# EAGLE design clock1_v1 (EAGLE 9.6.2)
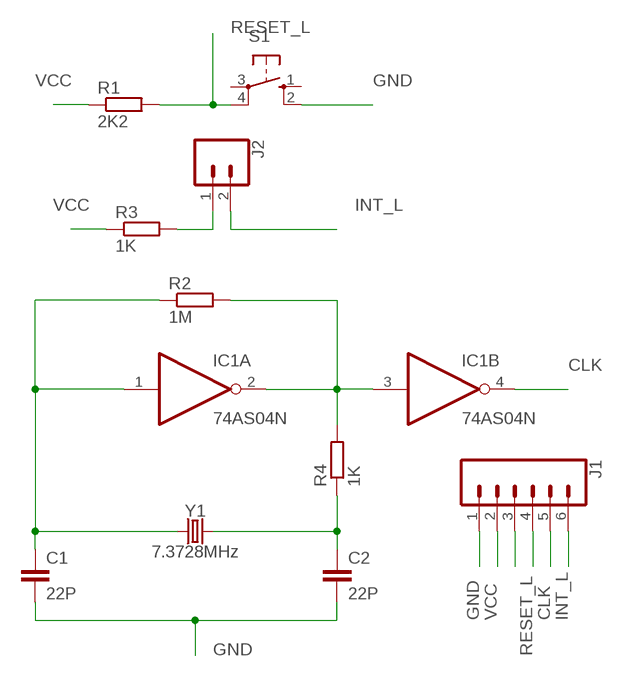
[diagram p0: schematic, sheet 1]

## Parts
C1  22P  C-EU025-024X044  [C025-024X044]
C2  22P  C-EU025-024X044  [C025-024X044]
IC1  74AS04N  [DIL14]
J1  CONN_06LONGPADS  [1X06_LONGPADS]
J2  CONN_02PTH3  [1X02_LONGPADS]
R1  2K2  R-EU_0204/5  [0204/5]
R2  1M  R-EU_0204/5  [0204/5]
R3  1K  R-EU_0204/5  [0204/5]
R4  1K  R-EU_0204/5  [0204/5]
S1  10-XX  [B3F-10XX]
Y1  7.3728MHz  CRYSTALPTH-HC49UV  [HC49U]

## Nets
CLK: IC1.4(B:O) J1.5
GND: C1.2 C2.2 J1.1 S1.2(S1)
INT_L: J1.6 J2.2
N$1: C1.1 IC1.1(A:I) R2.1 Y1.1
N$2: C2.1 R4.1 Y1.2
N$3: J1.3
N$4: IC1.2(A:O) IC1.3(B:I) R2.2 R4.2
N$6: J2.1 R3.2
RESET_L: J1.4 R1.2 S1.4(P1)
VCC: J1.2 R1.1 R3.1
Unconnected: IC1.5(C:I) IC1.6(C:O) IC1.8(D:O) IC1.9(D:I) IC1.10(E:O) IC1.11(E:I) IC1.12(F:O) IC1.13(F:I) S1.1(S) S1.3(P)

## Power pins joined to a net without a drawn wire
GND: IC1.7(P:GND)
VCC: IC1.14(P:VCC)

## Library data of the parts
C1 C2 = rcl:C-EU: CAPACITOR, European symbol; SPICEPREFIX: C
IC1 = 74xx-eu:74*04: Hex INVERTER
J1 = SparkFun-Connectors:CONN_06: Multi connection point. Often used as Generic Header-pin footprint for 0.1 inch spaced/style header connections On any of the 0.1 inch spaced packages, you can populate with these: Break Away Headers - Straight <https://www.sparkfun.com/products/116> (PRT-00116) Break Away Male Headers - Right Angle <https://www.sparkfun.com/products/553> (PRT-00553) Female Headers <https://www.sparkfun.com/products/115> (PRT-00115) Break Away Headers - Machine Pin <https://www.sparkfun.com/products/117> (PRT-00117) Break Away Female Headers - Swiss Machine Pin <https://www.sparkfun.com/products/743> (PRT-00743) Arduino Stackable Header - 6 Pin <https://www.sparkfun.com/products/9280> (PRT-09280) For SCREWTERMINALS and SPRING TERMINALS visit here: Screw Terimnals on SparkFun.com <https://www.sparkfun.com/search/results?term=Screw+Terminals> (5mm/3.5mm/2.54mm spacing) This device is also useful as a general connection point to wire up your design to another part of your project. Our various solder wires solder well into these plated through hole pads. Hook-Up Wire - Assortment (Stranded, 22 AWG) <https://www.sparkfun.com/products/11375> (PRT-11375) Hook-Up Wire - Assortment (Solid Core, 22 AWG) <https://www.sparkfun.com/products/11367> (PRT-11367) View the entire wire category on our website here <https://www.sparkfun.com/categories/141>
J2 = SparkFun-Connectors:CONN_02: Multi connection point. Often used as Generic Header-pin footprint for 0.1 inch spaced/style header connections On any of the 0.1 inch spaced packages, you can populate with these: Break Away Headers - Straight <https://www.sparkfun.com/products/116> (PRT-00116) Break Away Male Headers - Right Angle <https://www.sparkfun.com/products/553> (PRT-00553) Female Headers <https://www.sparkfun.com/products/115> (PRT-00115) Break Away Headers - Machine Pin <https://www.sparkfun.com/products/117> (PRT-00117) Break Away Female Headers - Swiss Machine Pin <https://www.sparkfun.com/products/743> (PRT-00743) For SCREWTERMINALS and SPRING TERMINALS visit here: Screw Terimnals on SparkFun.com <https://www.sparkfun.com/search/results?term=Screw+Terminals> (5mm/3.5mm/2.54mm spacing) This device is also useful as a general connection point to wire up your design to another part of your project. Our various solder wires solder well into these plated through hole pads. Hook-Up Wire - Assortment (Stranded, 22 AWG) <https://www.sparkfun.com/products/11375> (PRT-11375) Hook-Up Wire - Assortment (Solid Core, 22 AWG) <https://www.sparkfun.com/products/11367> (PRT-11367) View the entire wire category on our website here <https://www.sparkfun.com/categories/141> Special notes: Molex polarized connector foot print use with: PRT-08233 with associated crimp pins and housings. 2.54_SCREWTERM for use with PRT-10571. 3.5mm Screw Terminal footprints for PRT-08084 5mm Screw Terminal footprints for use with PRT-08432
R1-R4 = rcl:R-EU_: RESISTOR, European symbol; SPICEPREFIX: R
S1 = switch-omron:10-XX: OMRON SWITCH; MPN: B3F-1000; OC_FARNELL: 176432; OC_NEWARK: 36M3542
Y1 = SparkFun-Clocks:CRYSTAL: Crystals (Generic) These are passive quartz crystals, which can be used as a clock source for a microcontroller. Crystal's are two-terminal devices. They require external "load" capacitors to generate an oscillating signal.

## Board
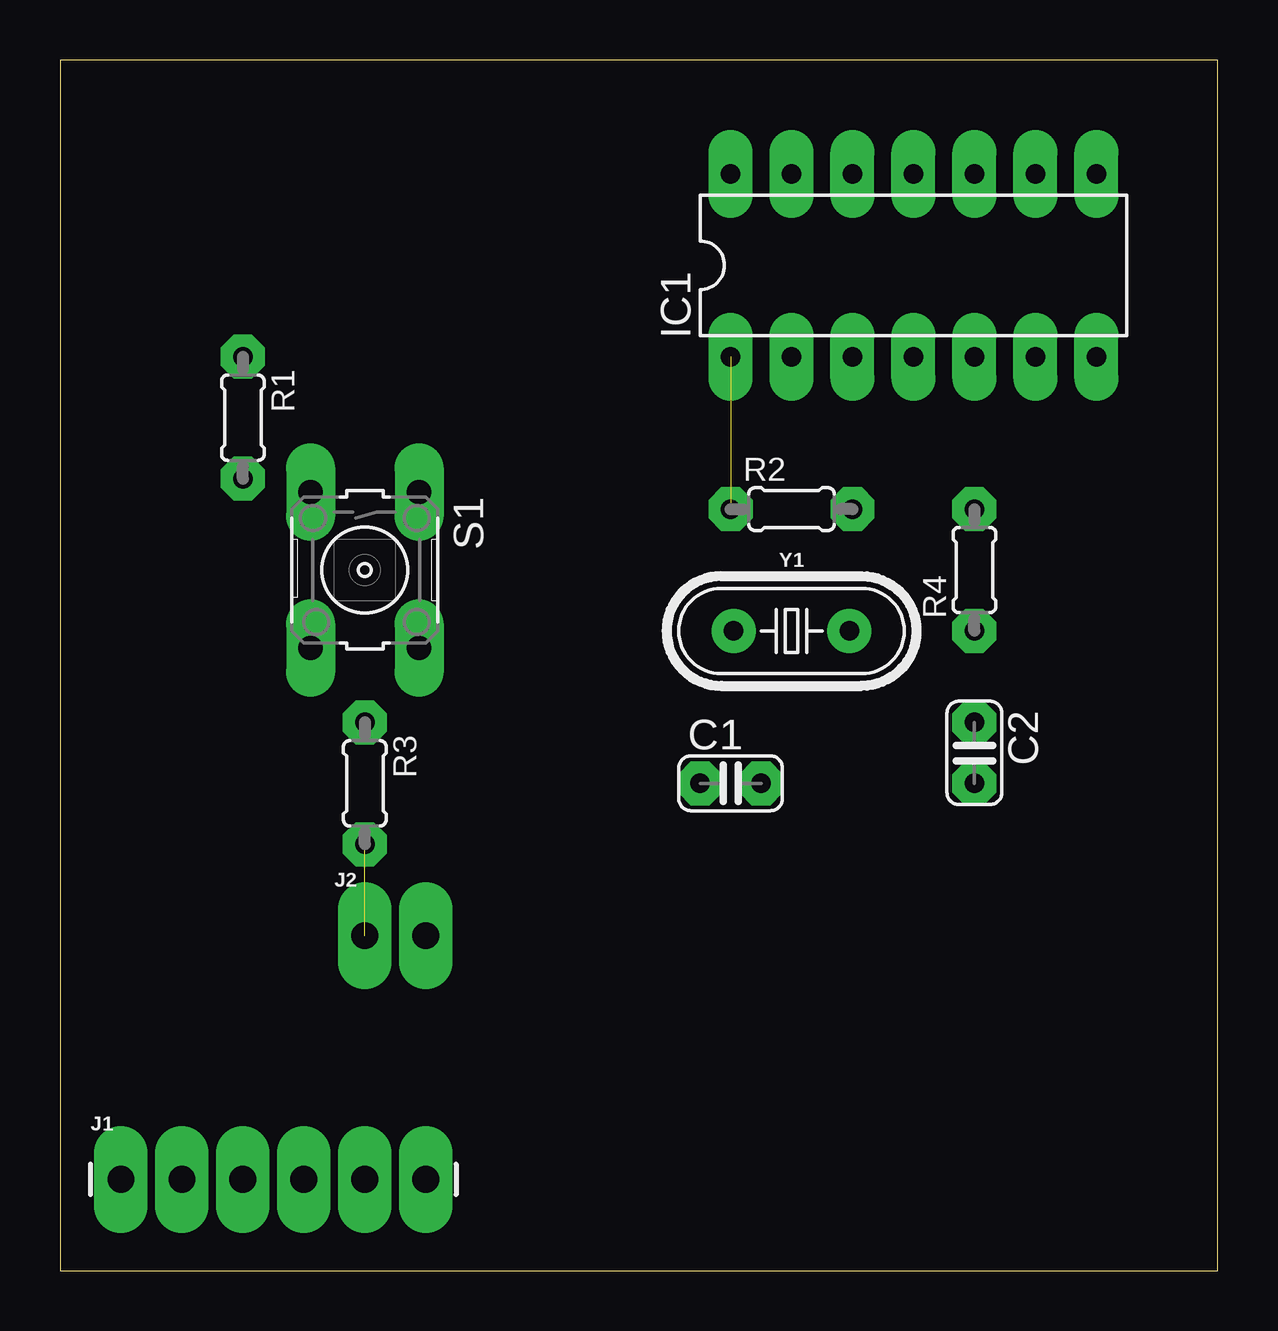
[diagram p1: board, top side]
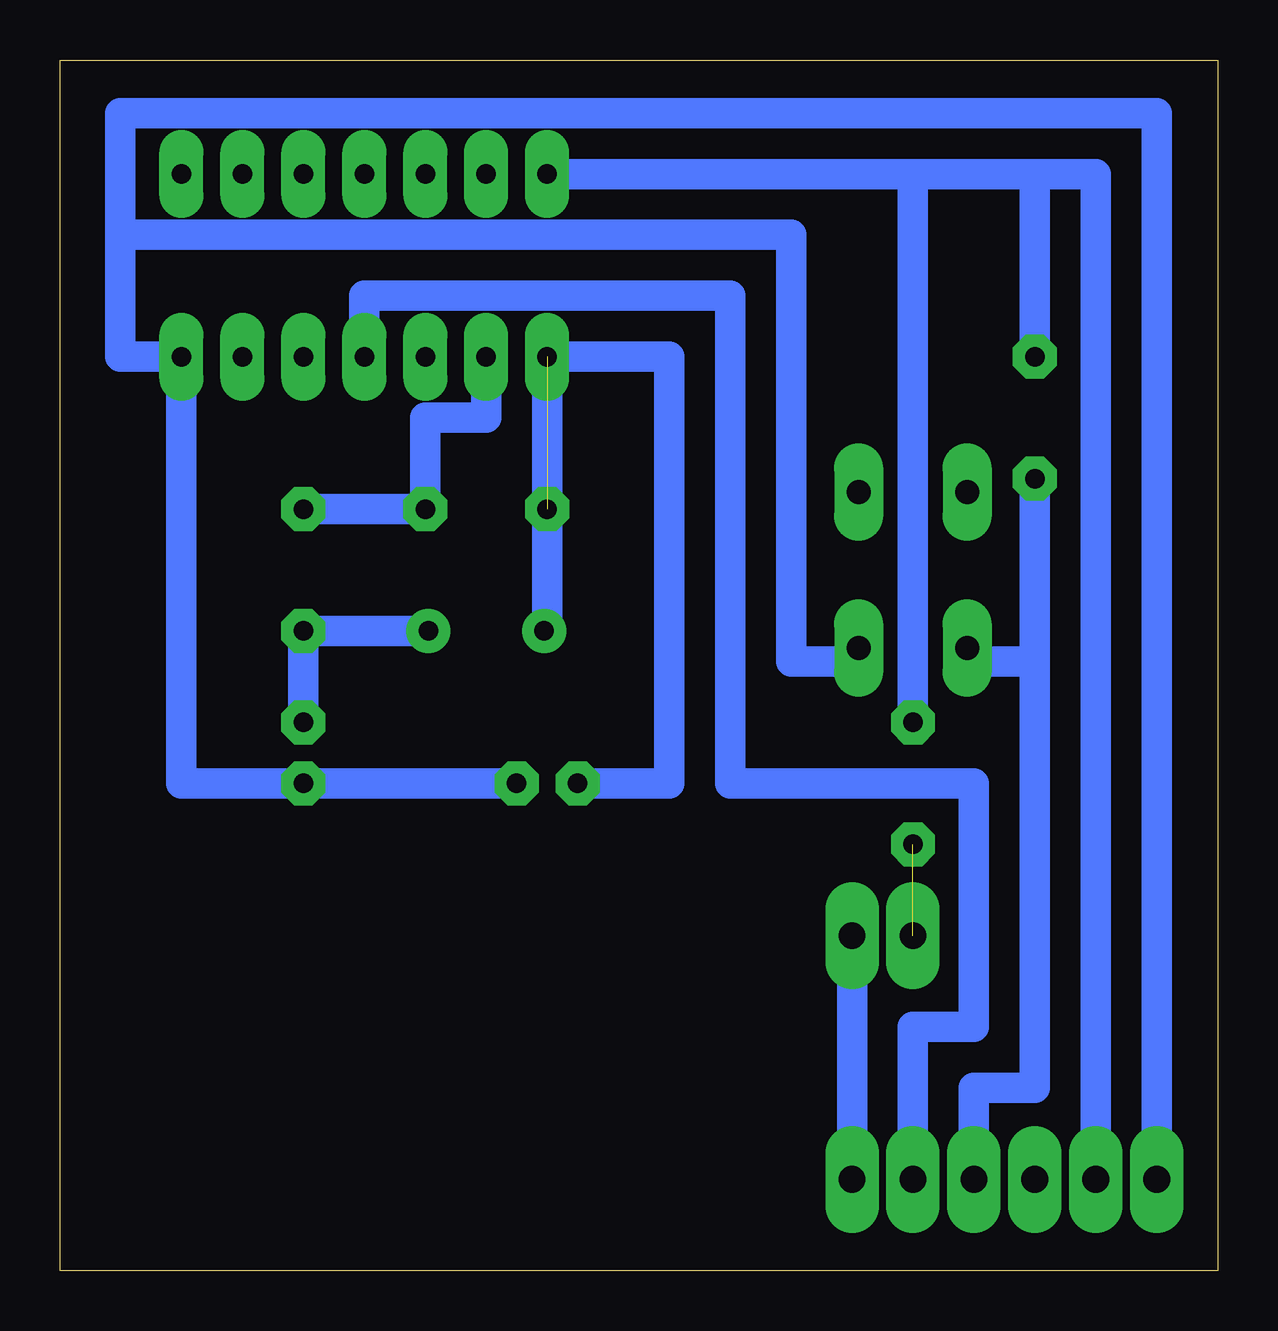
[diagram p2: board, bottom side, seen from below]

Size 48.24 x 50.47 mm. Coordinates in mm from the lower left corner, seen from the top.
Outline: 0,0 48.24,0 48.24,50.47 0,50.47 0,0
Copper layers (1*16): Top 0.035mm / dielectric 1.5mm / Bottom 0.035mm
Design rules "LabE": minimum track width 50mil, minimum drill 0.8mm, track to track 16mil, track to pad 16mil, pad to pad 16mil, via to via 16mil, smd to smd 16mil, copper to edge 0mil, drill to drill 16mil, minimum pad ring 20mil, minimum via ring 20mil, stop-mask expansion 4mil, vias tented up to drill 0mil, thermal gap 10mil

### Footprints (pad centres in the part's own frame; a part is rotated, then mirrored left to right if it is on the bottom)
C025-024X044 = drill 0.813 octagon: 1 -1.27,0; 2 1.27,0
DIL14 = drill 0.813 long: 1 -7.62,-3.81; 2 -5.08,-3.81; 3 -2.54,-3.81; 4 0,-3.81; 5 2.54,-3.81; 6 5.08,-3.81; 7 7.62,-3.81; 8 7.62,3.81; 9 5.08,3.81; 10 2.54,3.81; 11 0,3.81; 12 -2.54,3.81; 13 -5.08,3.81; 14 -7.62,3.81
1X06_LONGPADS = drill 1.118 pad 1.88 long: 1 0,0; 2 2.54,0; 3 5.08,0; 4 7.62,0; 5 10.16,0; 6 12.7,0
1X02_LONGPADS = drill 1.118 pad 1.88 long: 1 0,0; 2 2.54,0
0204/5 = drill 0.813 octagon: 1 -2.54,0; 2 2.54,0
B3F-10XX = drill 1.016 long: 1 -3.251,2.261; 2 3.251,2.261; 3 -3.251,-2.261; 4 3.251,-2.261
HC49U = drill 0.813: 1 -2.413,0; 2 2.413,0

### Placement (x,y rotation side)
C1  27.94,20.32 0 top
C2  38.1,21.59 270 top
IC1  35.56,41.91 0 top
J1  2.54,3.81 0 top
J2  12.7,13.97 0 top
R1  7.62,35.56 270 top
R2  30.48,31.75 0 top
R3  12.7,20.32 270 top
R4  38.1,29.21 90 top
S1  12.7,29.21 270 top
Y1  30.48,26.67 0 top

### Tracks (layer width: path | path; a pad name or v marks a point on that pad's centre or on a via)
CLK
  Bottom 1.27: IC1.4 35.56,40.64 20.32,40.64 20.32,20.32 10.16,20.32 10.16,10.16 12.7,10.16 J1.5
GND
  Bottom 1.27: J1.1 2.54,48.26 45.72,48.26 45.72,43.18 | 45.72,43.18 45.72,38.1 IC1.7 43.18,20.32 C2.2 C1.2 | 45.72,43.18 17.78,43.18 17.78,25.4 15.52,25.4 S1.2
INT_L
  Bottom 1.27: J2.2 J1.6
N$1  (4 unrouted)
  Bottom 1.27: C1.1 22.86,20.32 22.86,38.1 IC1.1 R2.1 27.94,26.8 Y1.1
N$2
  Bottom 1.27: Y1.2 R4.1 C2.1
N$4
  Bottom 1.27: IC1.2 30.48,35.56 33.02,35.56 R2.2 R4.2
N$6  (1 unrouted)
RESET_L
  Bottom 1.27: J1.4 10.16,7.62 7.62,7.62 7.62,25.4 | S1.4 9.88,25.4 7.62,25.4 | R1.2 7.62,25.4
VCC
  Bottom 1.27: IC1.14 12.7,45.72 | J1.2 5.08,45.72 7.62,45.72 | R3.1 12.7,45.72 | 7.62,45.72 12.7,45.72 | R1.1 7.62,45.72